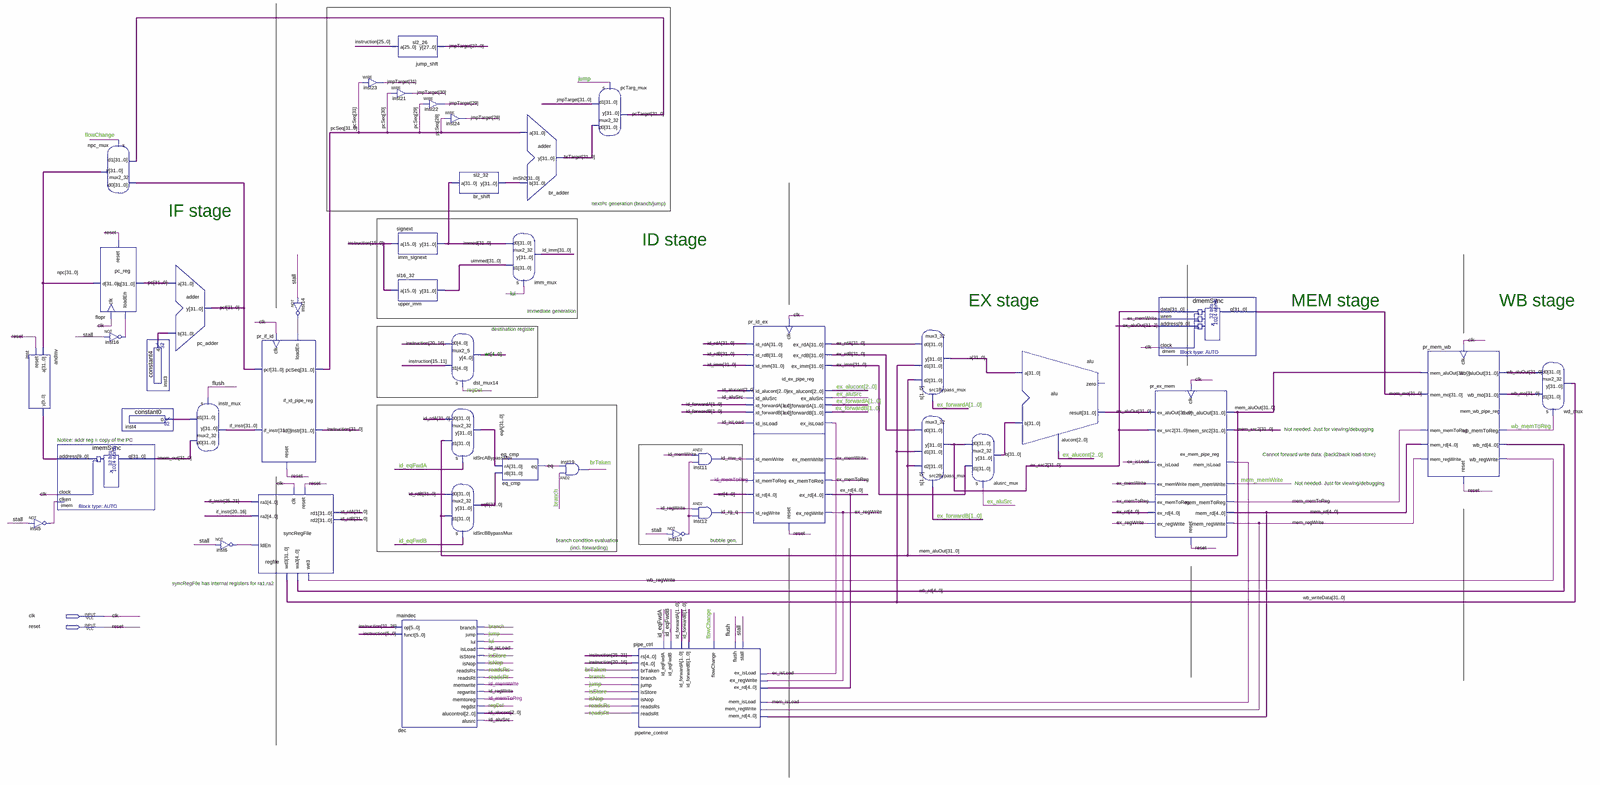
[diagram p0: schematic sheet, whole]
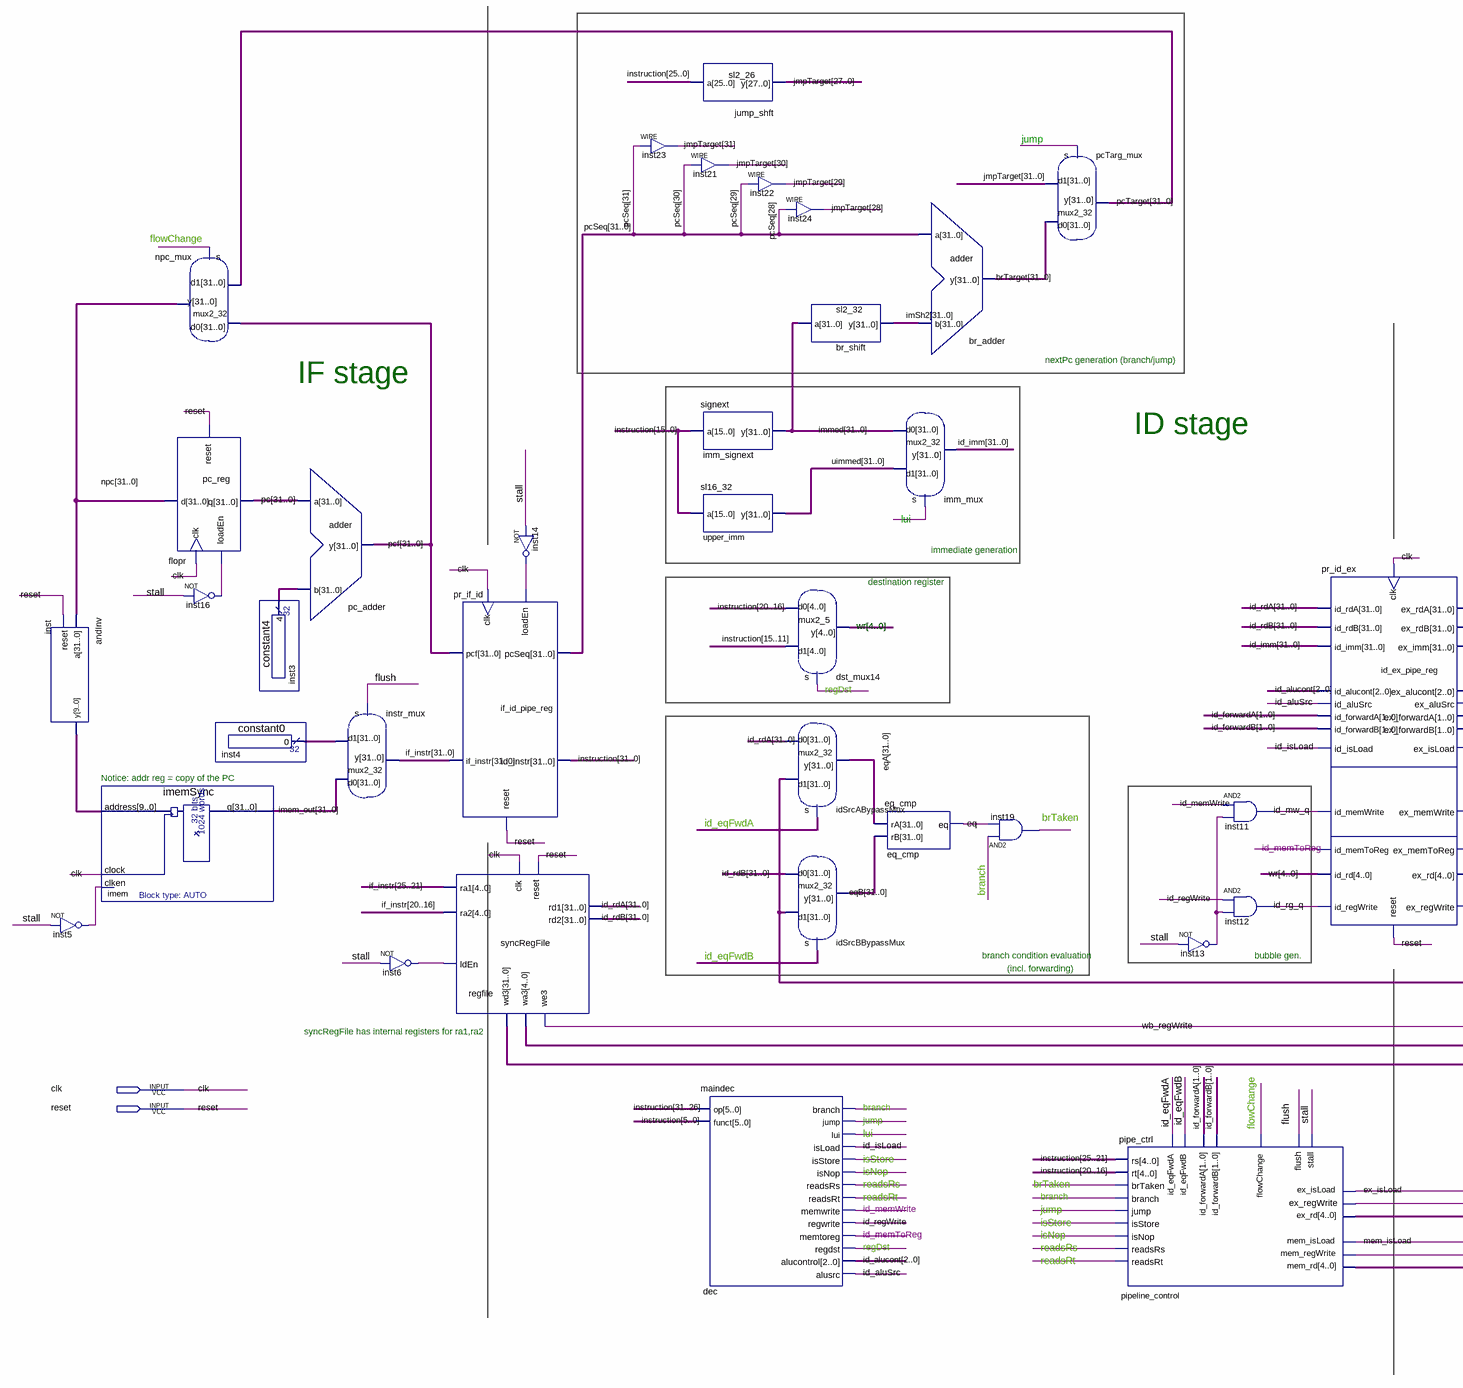
[diagram p1: schematic sheet, left part]
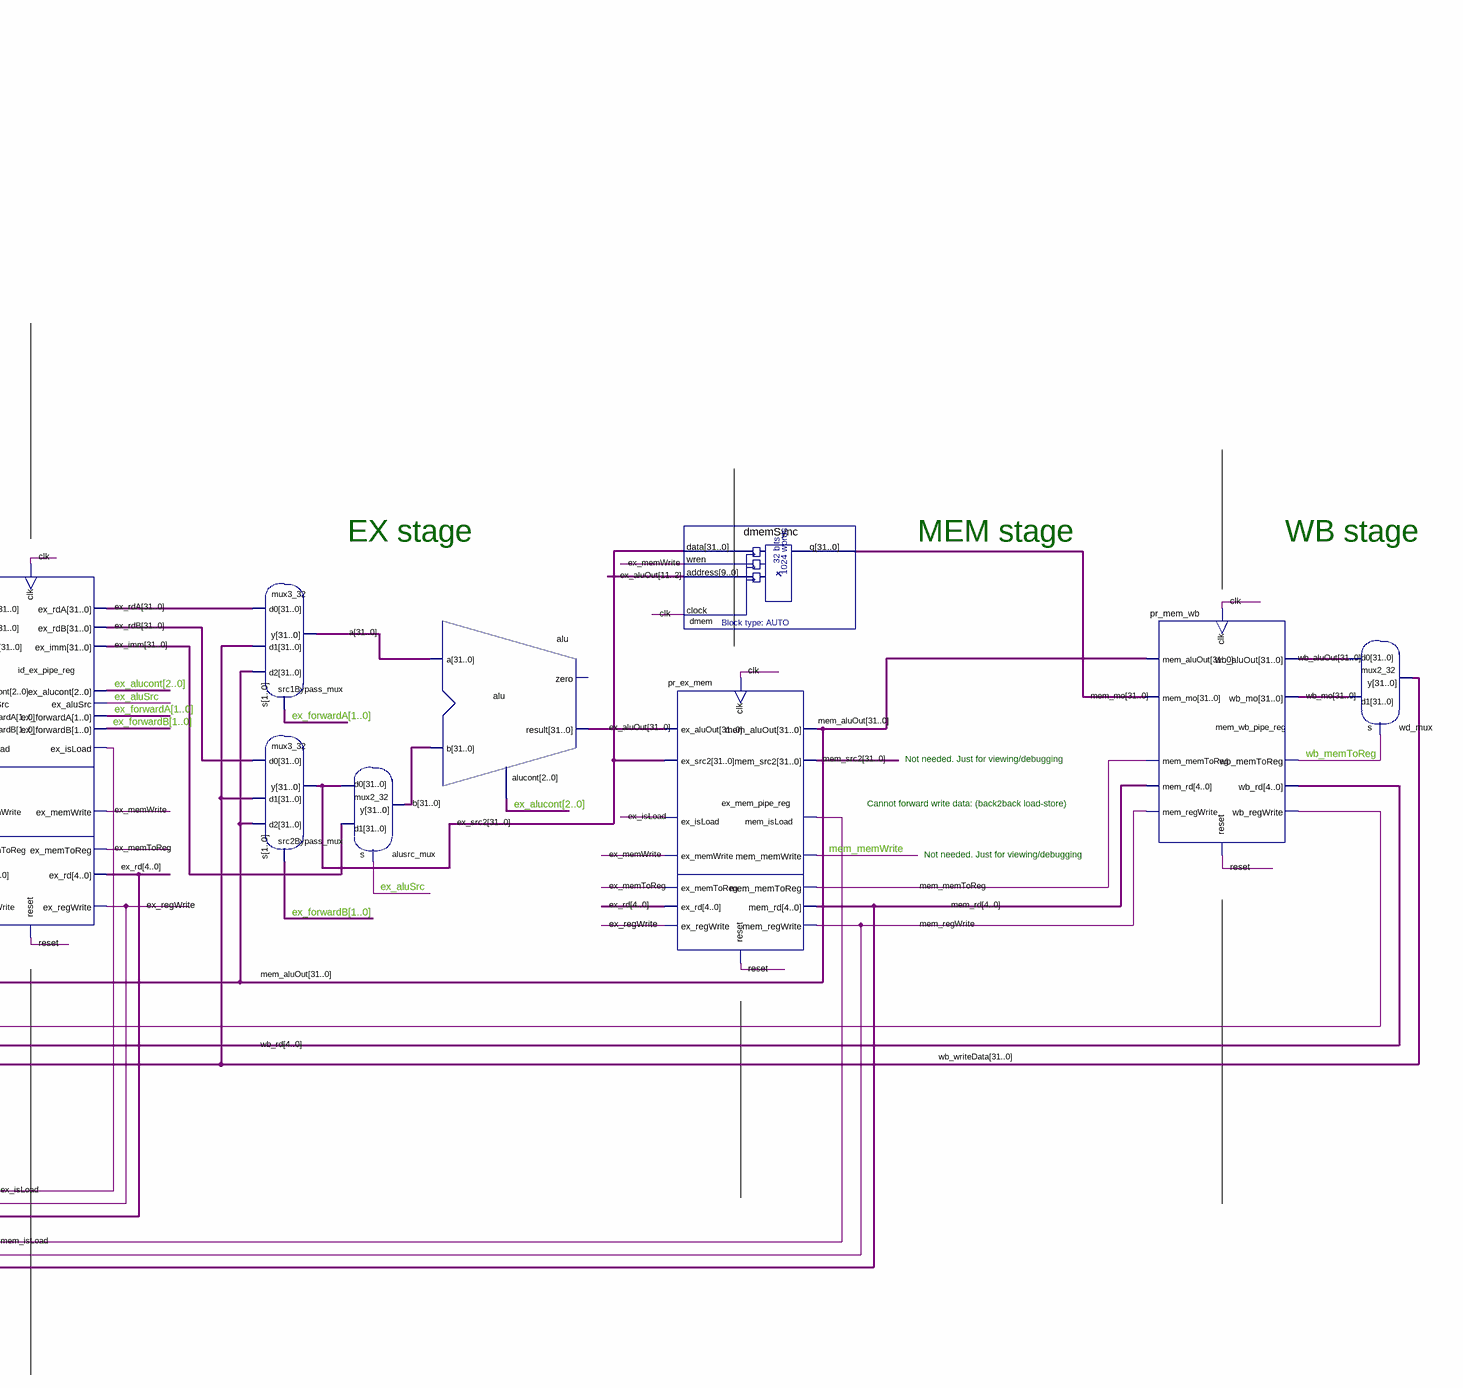
[diagram p2: schematic sheet, right part]
// Quartus schematic mips.bdf as structural Verilog: 44 symbols, 2 pins
module mips (
  input  clk,
  input  reset
);

  wire branch, brTaken, eq, ex_aluSrc, ex_isLoad, ex_memToReg, ex_memWrite, ex_regWrite, flowChange, flush,
       id_aluSrc, id_eqFwdA, id_eqFwdB, id_isLoad, id_memToReg, id_memWrite, id_mw_q, id_regWrite, id_rg_q,
       inst5_out, inst6_out, inst13_out, inst14_out, inst16_out, isNop, isStore, jump, lui, mem_isLoad,
       mem_memToReg, mem_memWrite, mem_regWrite, readsRs, readsRt, regDst, stall, wb_memToReg, wb_regWrite;
  wire [1:0] ex_forwardA, ex_forwardB, id_forwardA, id_forwardB;
  wire [2:0] ex_alucont, id_alucont;
  wire [4:0] ex_rd, mem_rd, wb_rd, wr;
  wire [9:0] inst_y;
  wire [31:0] a, b, brTarget, eqA, eqB, ex_aluOut, ex_imm, ex_rdA, ex_rdB, ex_src2, id_imm, id_rdA, id_rdB,
       if_instr, imem_out, immed, imSh2, inst3_result, inst4_result, instruction, jmpTarget, mem_aluOut,
       mem_mo, mem_src2, npc, pc, pcf, pcSeq, pcTarget, uimmed, wb_aluOut, wb_mo, wb_writeData;

  andInv inst (.a(npc), .reset(reset), .y(inst_y));
  not inst5 (inst5_out, stall);
  imemSync imem (.address(inst_y), .clock(clk), .clken(inst5_out), .q(imem_out));
  mux2_32 npc_mux (.d0(pcf), .d1(pcTarget), .s(flowChange), .y(npc));
  flopr pc_reg (.clk(clk), .reset(reset), .loadEn(inst16_out), .d(npc), .q(pc));
  not inst16 (inst16_out, stall);
  constant0 inst4 (.result(inst4_result));
  constant4 inst3 (.result(inst3_result));
  adder pc_adder (.a(pc), .b(inst3_result), .y(pcf));
  mux2_32 instr_mux (.d0(imem_out), .d1(inst4_result), .s(flush), .y(if_instr));
  not inst6 (inst6_out, stall);
  syncRegFile regfile (
    .clk(clk), .reset(reset), .we3(wb_regWrite), .ra1(if_instr[25:21]), .ra2(if_instr[20:16]),
    .ldEn(inst6_out), .wa3(wb_rd), .wd3(wb_writeData), .rd1(id_rdA), .rd2(id_rdB));
  pr_if_id if_id_pipe_reg (
    .clk(clk), .reset(reset), .loadEn(inst14_out), .pcf(pcf), .if_instr(if_instr), .pcSeq(pcSeq),
    .id_instr(instruction));
  not inst14 (inst14_out, stall);
  assign jmpTarget[31] = pcSeq[31];  // WIRE inst23
  sl2_26 jump_shft (.a(instruction[25:0]), .y(jmpTarget[27:0]));
  assign jmpTarget[30] = pcSeq[30];  // WIRE inst21
  signext imm_signext (.a(instruction[15:0]), .y(immed));
  sl16_32 upper_imm (.a(instruction[15:0]), .y(uimmed));
  maindec dec (
    .op(instruction[31:26]), .funct(instruction[5:0]), .branch(branch), .jump(jump), .lui(lui),
    .isLoad(id_isLoad), .isStore(isStore), .isNop(isNop), .readsRs(readsRs), .readsRt(readsRt),
    .memwrite(id_memWrite), .regwrite(id_regWrite), .memtoreg(id_memToReg), .regdst(regDst),
    .alucontrol(id_alucont), .alusrc(id_aluSrc));
  assign jmpTarget[29] = pcSeq[29];  // WIRE inst22
  assign jmpTarget[28] = pcSeq[28];  // WIRE inst24
  sl2_32 br_shift (.a(immed), .y(imSh2));
  mux2_5 dst_mux14 (.d0(instruction[20:16]), .d1(instruction[15:11]), .s(regDst), .y(wr));
  mux2_32 idSrcABypassMux (.d0(id_rdA), .d1(mem_aluOut), .s(id_eqFwdA), .y(eqA));
  mux2_32 idSrcBBypassMux (.d0(id_rdB), .d1(mem_aluOut), .s(id_eqFwdB), .y(eqB));
  mux2_32 imm_mux (.d0(immed), .d1(uimmed), .s(lui), .y(id_imm));
  eq_cmp eq_cmp (.rA(eqA), .rB(eqB), .eq(eq));
  adder br_adder (.a(pcSeq), .b(imSh2), .y(brTarget));
  and inst19 (brTaken, branch, eq);
  mux2_32 pcTarg_mux (.d0(brTarget), .d1(jmpTarget), .s(jump), .y(pcTarget));
  pipe_ctrl pipeline_control (
    .rs(instruction[25:21]), .rt(instruction[20:16]), .isStore(isStore), .isNop(isNop), .readsRs(readsRs),
    .readsRt(readsRt), .branch(branch), .jump(jump), .brTaken(brTaken), .ex_rd(ex_rd),
    .ex_regWrite(ex_regWrite), .ex_isLoad(ex_isLoad), .mem_rd(mem_rd), .mem_regWrite(mem_regWrite),
    .mem_isLoad(mem_isLoad), .flush(flush), .flowChange(flowChange), .stall(stall),
    .id_forwardA(id_forwardA), .id_forwardB(id_forwardB), .id_eqFwdA(id_eqFwdA), .id_eqFwdB(id_eqFwdB));
  not inst13 (inst13_out, stall);
  and inst11 (id_mw_q, id_memWrite, inst13_out);
  and inst12 (id_rg_q, id_regWrite, inst13_out);
  pr_id_ex id_ex_pipe_reg (
    .clk(clk), .reset(reset), .id_rdA(id_rdA), .id_rdB(id_rdB), .id_imm(id_imm), .id_isLoad(id_isLoad),
    .id_alucont(id_alucont), .id_aluSrc(id_aluSrc), .id_forwardA(id_forwardA), .id_forwardB(id_forwardB),
    .id_memWrite(id_mw_q), .id_memToReg(id_memToReg), .id_rd(wr), .id_regWrite(id_rg_q), .ex_rdA(ex_rdA),
    .ex_rdB(ex_rdB), .ex_imm(ex_imm), .ex_isLoad(ex_isLoad), .ex_alucont(ex_alucont), .ex_aluSrc(ex_aluSrc),
    .ex_forwardA(ex_forwardA), .ex_forwardB(ex_forwardB), .ex_memWrite(ex_memWrite),
    .ex_memToReg(ex_memToReg), .ex_rd(ex_rd), .ex_regWrite(ex_regWrite));
  mux3_32 src1Bypass_mux (.d0(ex_rdA), .d1(wb_writeData), .d2(mem_aluOut), .s(ex_forwardA), .y(a));
  mux3_32 src2Bypass_mux (.d0(ex_rdB), .d1(wb_writeData), .d2(mem_aluOut), .s(ex_forwardB), .y(ex_src2));
  mux2_32 alusrc_mux (.d0(ex_src2), .d1(ex_imm), .s(ex_aluSrc), .y(b));
  alu alu (.a(a), .b(b), .alucont(ex_alucont), .result(ex_aluOut));  // open: zero
  dmemSync dmem (.data(ex_src2), .wren(ex_memWrite), .address(ex_aluOut[11:2]), .clock(clk), .q(mem_mo));
  pr_ex_mem ex_mem_pipe_reg (
    .clk(clk), .reset(reset), .ex_aluOut(ex_aluOut), .ex_src2(ex_src2), .ex_memWrite(ex_memWrite),
    .ex_isLoad(ex_isLoad), .ex_memToReg(ex_memToReg), .ex_rd(ex_rd), .ex_regWrite(ex_regWrite),
    .mem_isLoad(mem_isLoad), .mem_aluOut(mem_aluOut), .mem_src2(mem_src2), .mem_memWrite(mem_memWrite),
    .mem_memToReg(mem_memToReg), .mem_rd(mem_rd), .mem_regWrite(mem_regWrite));
  pr_mem_wb mem_wb_pipe_reg (
    .clk(clk), .reset(reset), .mem_aluOut(mem_aluOut), .mem_mo(mem_mo), .mem_memToReg(mem_memToReg),
    .mem_rd(mem_rd), .mem_regWrite(mem_regWrite), .wb_aluOut(wb_aluOut), .wb_mo(wb_mo),
    .wb_memToReg(wb_memToReg), .wb_rd(wb_rd), .wb_regWrite(wb_regWrite));
  mux2_32 wd_mux (.d0(wb_aluOut), .d1(wb_mo), .s(wb_memToReg), .y(wb_writeData));

  // Notes on the sheet:
  //   IF stage
  //   nextPc generation (branch/jump)
  //   ID stage
  //   EX stage
  //   MEM stage
  //   WB stage
  //   immediate generation
  //   destination register
  //   wr[4..0]
  //   Not needed. Just for viewing/debugging
  //   Notice: addr reg = copy of the PC
  //   Cannot forward write data: (back2back load-store)
  //   Not needed. Just for viewing/debugging
  //   branch condition evaluation
  //   bubble gen.
  //   (incl. forwarding)
  //   syncRegFile has internal registers for ra1,ra2
endmodule
